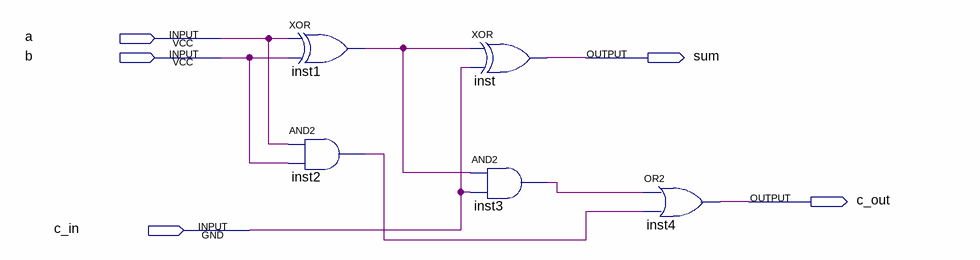
[diagram p0: schematic sheet]
// Quartus schematic adder.bdf as structural Verilog: 5 symbols, 5 pins
module adder (
  input  a,
  input  b,
  input  c_in,
  output sum,
  output c_out
);

  wire inst1_out, inst2_out, inst3_out;

  xor inst1 (inst1_out, a, b);
  and inst2 (inst2_out, a, b);
  xor inst (sum, inst1_out, c_in);
  and inst3 (inst3_out, inst1_out, c_in);
  or inst4 (c_out, inst3_out, inst2_out);
endmodule
